# EAGLE design portable_tpa6138a2 (EAGLE 6.4)
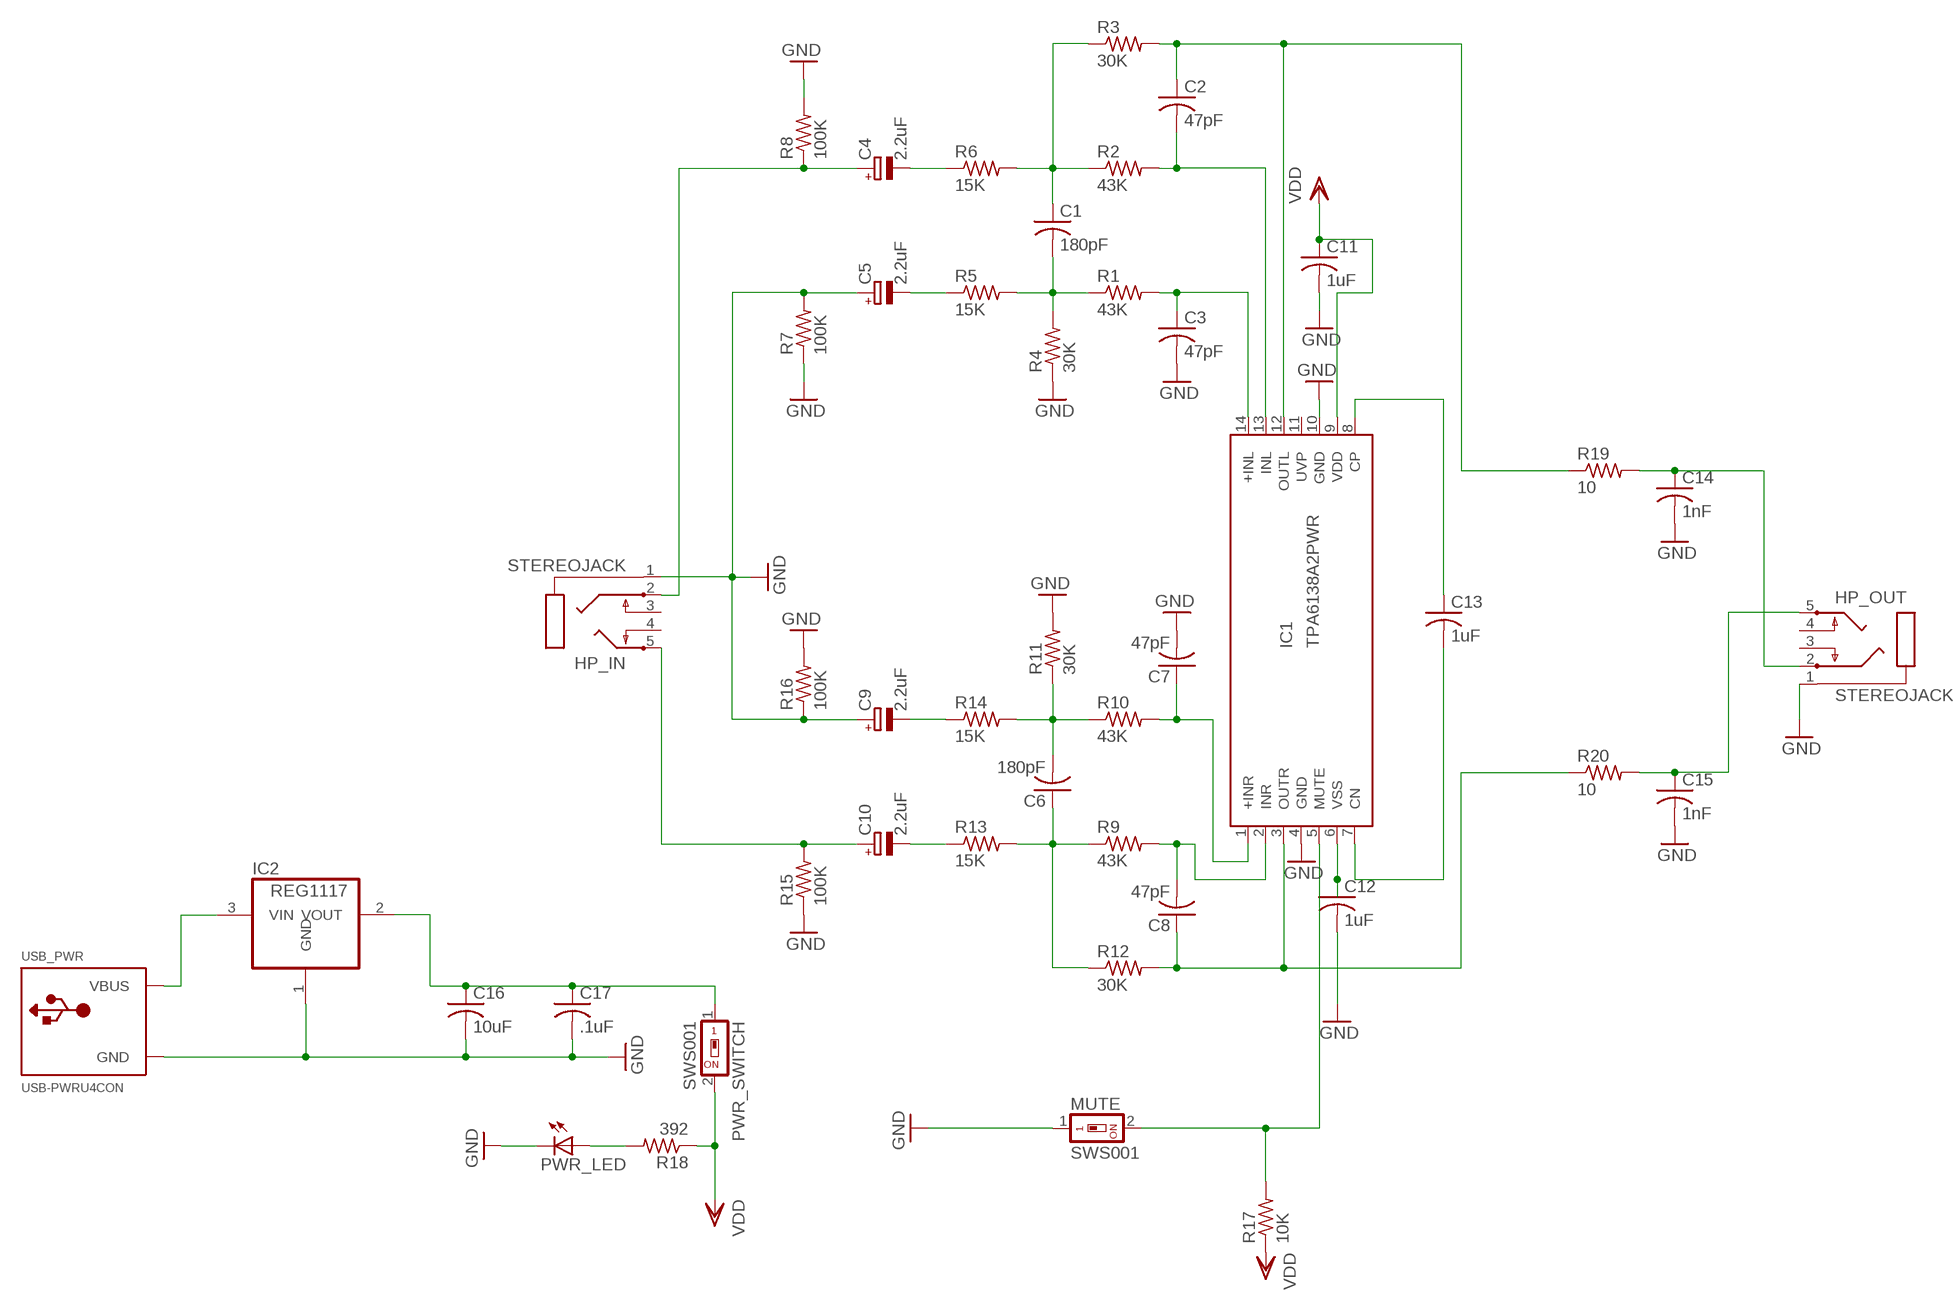
[diagram p0: schematic, sheet 1]

## Parts
C1  180pF  C-USC0603  [C0603]
C2  47pF  C-USC0603  [C0603]
C3  47pF  C-USC0603  [C0603]
C4  2.2uF  CPOL-EU153CLV-0405  [153CLV-0405]
C5  2.2uF  CPOL-EU153CLV-0405  [153CLV-0405]
C6  180pF  C-USC0603  [C0603]
C7  47pF  C-USC0603  [C0603]
C8  47pF  C-USC0603  [C0603]
C9  2.2uF  CPOL-EU153CLV-0405  [153CLV-0405]
C10  2.2uF  CPOL-EU153CLV-0405  [153CLV-0405]
C11  1uF  C-USC0603  [C0603]
C12  1uF  C-USC0603  [C0603]
C13  1uF  C-USC0603  [C0603]
C14  1nF  C-USC0603  [C0603]
C15  1nF  C-USC0603  [C0603]
C16  10uF  C-USC0805  [C0805]
C17  .1uF  C-USC0603  [C0603]
HP_IN  STEREOJACK  [STX3100]
HP_OUT  STEREOJACK  [STX3100]
IC1  TPA6138A2PWR  [TSSOP14]
IC2  REG1117  [SOT223]
MUTE  SWS001  [SMS-001]
PWR_LED  LED  [SMARTLED-TTW]
PWR_SWITCH  SWS001  [SMS-001]
R1  43K  R-US_R0603  [R0603]
R2  43K  R-US_R0603  [R0603]
R3  30K  R-US_R0603  [R0603]
R4  30K  R-US_R0603  [R0603]
R5  15K  R-US_R0603  [R0603]
R6  15K  R-US_R0603  [R0603]
R7  100K  R-US_R0603  [R0603]
R8  100K  R-US_R0603  [R0603]
R9  43K  R-US_R0603  [R0603]
R10  43K  R-US_R0603  [R0603]
R11  30K  R-US_R0603  [R0603]
R12  30K  R-US_R0603  [R0603]
R13  15K  R-US_R0603  [R0603]
R14  15K  R-US_R0603  [R0603]
R15  100K  R-US_R0603  [R0603]
R16  100K  R-US_R0603  [R0603]
R17  10K  R-US_R0603  [R0603]
R18  392  R-US_R0603  [R0603]
R19  10  R-US_R0603  [R0603]
R20  10  R-US_R0603  [R0603]
USB_PWR  USB-PWRU4CON  [USB-MINIB-THM-PWRONLY]

## Nets
GND: C3.2 C5.+ C7.2 C9.+ C11.2 C12.2 C14.2 C15.2 C16.2 C17.2 HP_IN.1 HP_OUT.1 IC1.4(GND) IC1.10(GND) IC2.1(GND) MUTE.1 PWR_LED.C@1(C) R4.1 R7.1 R7.2 R8.2 R11.2 R15.1 R16.1 R16.2 USB_PWR.GND
N$1: IC2.3(VIN) USB_PWR.VBUS
N$2: PWR_LED.A@1(A) R18.2
N$3: C4.+ HP_IN.2 R8.1
N$4: C4.- R6.1
N$5: C1.1 R2.1 R3.1 R6.2
N$6: C10.+ HP_IN.5 R15.2
N$7: C5.- R5.1
N$8: C1.2 R1.1 R4.2 R5.2
N$9: C2.2 IC1.13(INL) R2.2
N$10: C2.1 IC1.12(OUTL) R3.2 R19.1
N$11: C6.2 R10.1 R11.1 R14.2
N$12: C7.1 IC1.1(+INR) R10.2
N$13: C3.1 IC1.14(+INL) R1.2
N$14: C10.- R13.1
N$15: C6.1 R9.1 R12.1 R13.2
N$16: C8.2 IC1.2(INR) R9.2
N$17: C8.1 IC1.3(OUTR) R12.2 R20.1
N$18: C13.2 IC1.7(CN)
N$19: C13.1 IC1.8(CP)
N$20: C12.1 IC1.6(VSS)
N$21: C14.1 HP_OUT.2 R19.2
N$22: C15.1 HP_OUT.5 R20.2
N$23: C9.- R14.1
N$25: IC1.5(MUTE) MUTE.2 R17.2
N$26: C16.1 C17.1 IC2.2(VOUT) PWR_SWITCH.1
VDD: C11.1 IC1.9(VDD) PWR_SWITCH.2 R17.1 R18.1
Unconnected: HP_IN.3 HP_IN.4 HP_OUT.3 HP_OUT.4 IC1.11(UVP)

## Library data of the parts
C1-C3 C6-C8 C11-C17 = rcl:C-US: CAPACITOR, American symbol
C4 C5 C9 C10 = rcl:CPOL-EU: POLARIZED CAPACITOR, European symbol
HP_IN HP_OUT = adafruit:STEREOJACK: MIC/HEADPHONE JACK Stereo jack with two switches. Kycon STX3100, CUI SJ1-3555NG and/or 4UCon 05544
IC1 = TPA6138A2PWR:TPA6138A2PWR: edit this description Auto generated by make-symbol-device-package-bsdl.ulp Rev. 43 Source:
IC2 = burr-brown:REG1117: 800mA and 1A Low Dropout (LDO) Positive Regulator 1.8V, 2.5V, 2.85V, 3.3V, 5V, and Adj; MPN: REG1117; OC_FARNELL: 1097566; OC_NEWARK: 14P6981
MUTE PWR_SWITCH = smd-special:SWS001: SMD Dip Switch 1 pol.
PWR_LED = led:LED: LED OSRAM: - CHIPLED LG R971, LG N971, LY N971, LG Q971, LY Q971, LO R971, LY R971 LH N974, LH R974 LS Q976, LO Q976, LY Q976 LO Q996 - Hyper CHIPLED LW Q18S LB Q993, LB Q99A, LB R99A - SideLED LS A670, LO A670, LY A670, LG A670, LP A670 LB A673, LV A673, LT A673, LW A673 LH A674 LY A675 LS A676, LA A676, LO A676, LY A676, LW A676 LS A679, LY A679, LG A679 - Hyper Micro SIDELED® LS Y876, LA Y876, LO Y876, LY Y876 LT Y87S - SmartLED LW L88C, LW L88S LB L89C, LB L89S, LG L890 LS L89K, LO L89K, LY L89K LS L896, LA L896, LO L896, LY L896 - TOPLED LS T670, LO T670, LY T670, LG T670, LP T670 LSG T670, LSP T670, LSY T670, LOP T670, LYG T670 LG T671, LOG T671, LSG T671 LB T673, LV T673, LT T673, LW T673 LH T674 LS T676, LA T676, LO T676, LY T676, LB T676, LH T676, LSB T676, LW T676 LB T67C, LV T67C, LT T67C, LS T67K, LO T67K, LY T67K, LW E67C LS E67B, LA E67B, LO E67B, LY E67B, LB E67C, LV E67C, LT E67C LW T67C LS T679, LY T679, LG T679 LS T770, LO T770, LY T770, LG T770, LP T770 LB T773, LV T773, LT T773, LW T773 LH T774 LS E675, LA E675, LY E675, LS T675 LS T776, LA T776, LO T776, LY T776, LB T776 LHGB T686 LT T68C, LB T68C - Hyper Mini TOPLED® LB M676 - Mini TOPLED Santana® LG M470 LS M47K, LO M47K, LY M47K Source: http://www.osram.convergy.de LUXEON: - LUMILED® LXK2-PW12-R00, LXK2-PW12-S00, LXK2-PW14-U00, LXK2-PW14-V00 LXK2-PM12-R00, LXK2-PM12-S00, LXK2-PM14-U00 LXK2-PE12-Q00, LXK2-PE12-R00, LXK2-PE12-S00, LXK2-PE14-T00, LXK2-PE14-U00 LXK2-PB12-K00, LXK2-PB12-L00, LXK2-PB12-M00, LXK2-PB14-N00, LXK2-PB14-P00, LXK2-PB14-Q00 LXK2-PR12-L00, LXK2-PR12-M00, LXK2-PR14-Q00, LXK2-PR14-R00 LXK2-PD12-Q00, LXK2-PD12-R00, LXK2-PD12-S00 LXK2-PH12-R00, LXK2-PH12-S00 LXK2-PL12-P00, LXK2-PL12-Q00, LXK2-PL12-R00 Source: www.luxeon.com KINGBRIGHT: KA-3528ASYC Source: www.kingbright.com
R1-R20 = rcl:R-US_: RESISTOR, American symbol
USB_PWR = adafruit:USB-PWR

## Board
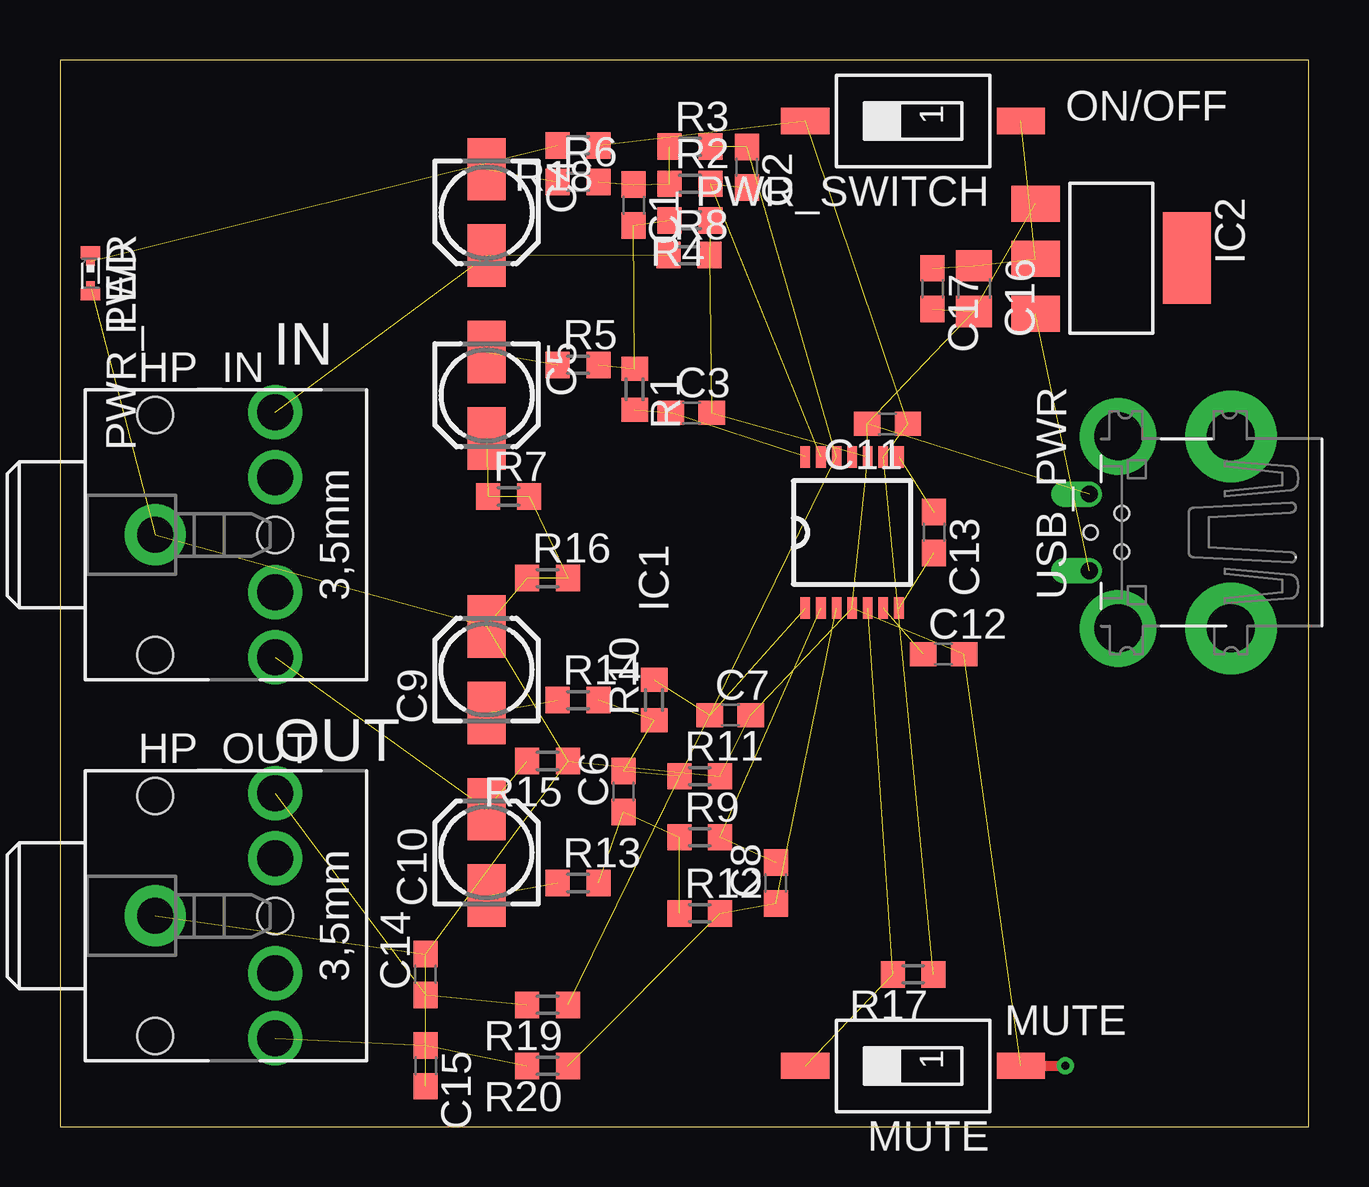
[diagram p1: board, top side]
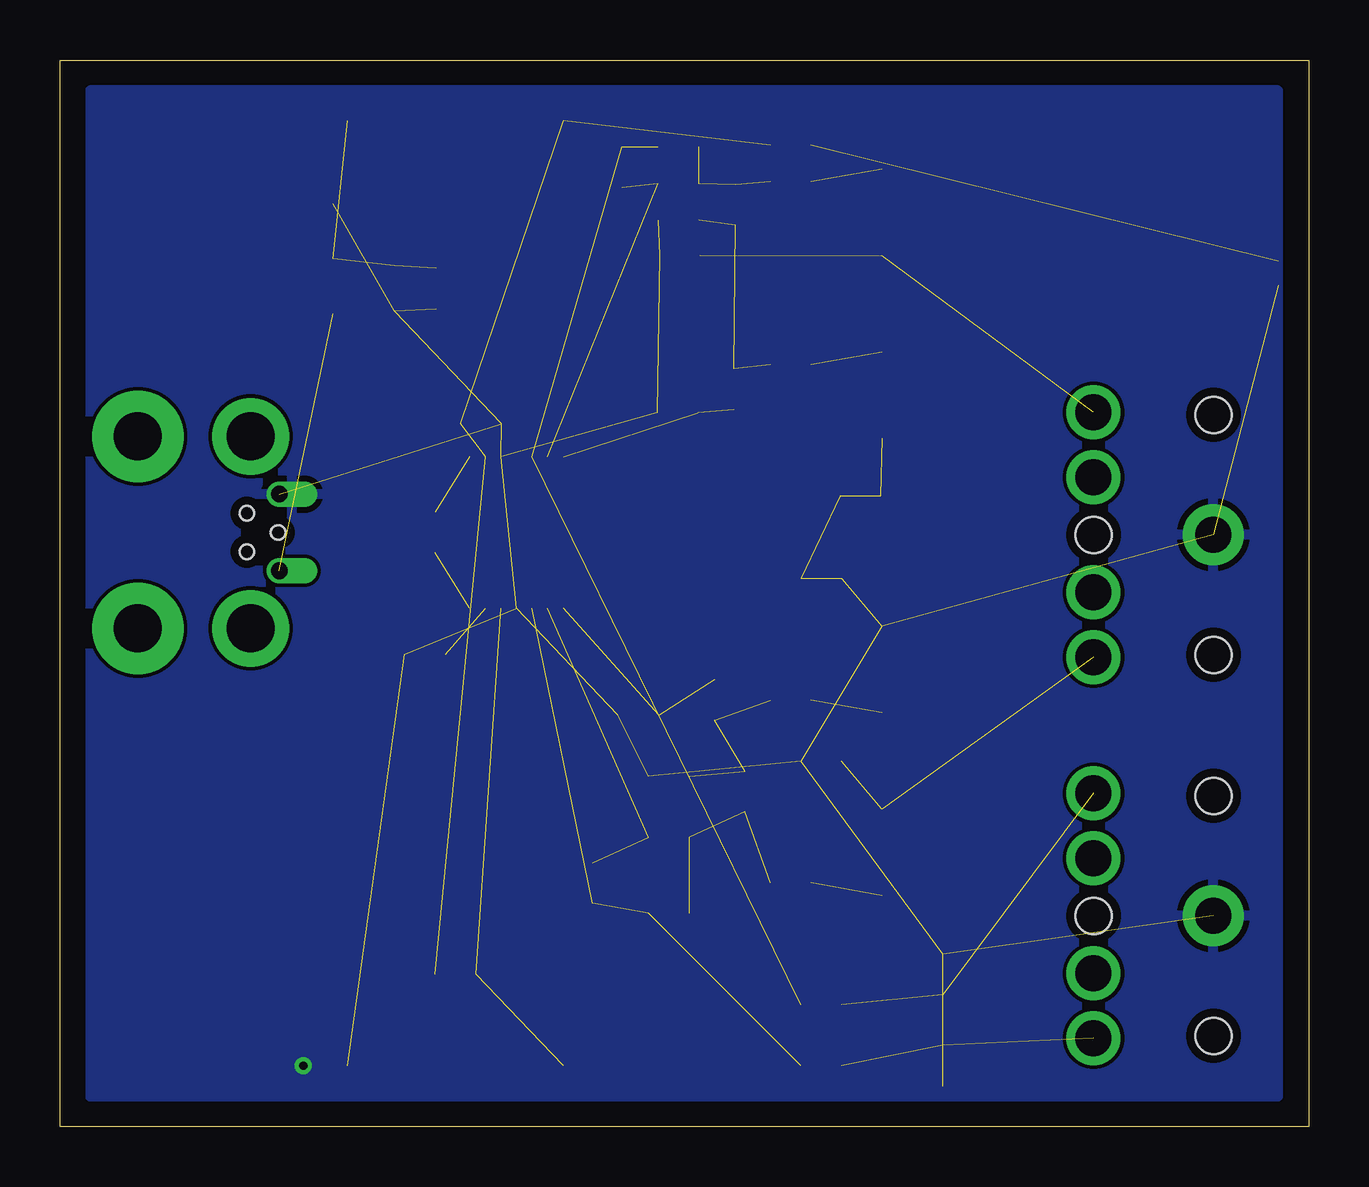
[diagram p2: board, bottom side, seen from below]

Size 52.05 x 44.45 mm. Coordinates in mm from the lower left corner, seen from the top.
Outline: 0,0 52.05,0 52.05,44.45 0,44.45 0,0
Copper layers (1*16): Top 0.0356mm / dielectric 1.5011mm / Bottom 0.0356mm
Design rules "LaenPCBOrder *": minimum track width 6mil, minimum drill 13mil, track to track 6mil, track to pad 6mil, pad to pad 6mil, via to via 6mil, smd to smd 6mil, copper to edge 15mil, drill to drill 6mil, minimum pad ring 7mil, minimum via ring 7mil, stop-mask expansion 4mil, vias tented up to drill 24mil, thermal gap 10mil

### Footprints (pad centres in the part's own frame; a part is rotated, then mirrored left to right if it is on the bottom)
C0603 = smd 1.1 x 1: 1 -0.85,0; 2 0.85,0
153CLV-0405 = smd 2.6 x 1.6: + 1.8,0; - -1.8,0
C0805 = smd 1.3 x 1.5: 1 -0.95,0; 2 0.95,0
STX3100 = drill 1.5 pad 2.54: 1 2.7,-0.1 | drill 1.5: 2 7.7,5; 3 7.7,2.3; 4 7.7,-2.5; 5 7.7,-5.2 | hole 1.5: 2.7,4.9; 2.7,-5.1; 7.7,-0.1
TSSOP14 = smd 0.9 x 0.4: 1 -3.15,1.95; 2 -3.15,1.3; 3 -3.15,0.65; 4 -3.15,0; 5 -3.15,-0.65; 6 -3.15,-1.3; 7 -3.15,-1.95; 8 3.15,-1.95; 9 3.15,-1.3; 10 3.15,-0.65; 11 3.15,0; 12 3.15,0.65; 13 3.15,1.3; 14 3.15,1.95
SOT223 = smd 1.499 x 2.007: 1 -2.261,-3.15; 2 0.025,-3.15; 3 2.311,-3.15 | smd 3.81 x 2.007: 4 0,3.15
SMS-001 = smd 1.092 x 2.007: 1 0,-4.496; 2 0,4.496
SMARTLED-TTW = smd 0.8 x 0.5: A 0,-0.875; C 0,0.875 | smd 0.35 x 0.35: A@1 0,-0.5; C@1 0,0.5
R0603 = smd 1 x 1.1: 1 -0.85,0; 2 0.85,0
USB-MINIB-THM-PWRONLY = drill 0.7 offset: GND 1.6,4.72; VBUS -1.6,4.72 | drill 2 pad 3.81: GND1 -4,-1.18; GND4 4,-1.18 | drill 2 pad 3.2: GND2 -4,3.52; GND3 4,3.52 | hole 0.6: -0.8,3.37; 0.8,3.37; 0,4.67

### Placement (x,y rotation side)
C1  23.9,38.4 270 top
C2  28.63,39.98 270 top
C3  26.31,29.74 0 top
C4  17.78,38.1 270 top
C5  17.78,30.48 270 top
C6  23.5,13.97 90 top
C7  27.94,17.14 0 top
C8  29.84,10.16 90 top
C9  17.78,19.05 90 top
C10  17.78,11.43 90 top
C11  34.49,29.29 180 top
C12  36.83,19.68 0 top
C13  36.42,24.76 270 top
C14  15.24,6.35 90 top
C15  15.24,2.54 270 top
C16  38.1,34.92 270 top
C17  36.37,34.92 270 top
HP_IN  1.27,24.76 0 top
HP_OUT  1.27,8.89 0 top
IC1  33.02,24.76 90 top
IC2  43.81,36.2 270 top
MUTE  35.56,2.54 90 top
PWR_LED  1.27,35.56 180 top
PWR_SWITCH  35.56,41.91 90 top
R1  23.95,30.73 270 top
R2  26.26,39.29 0 top
R3  26.26,40.84 0 top
R4  26.26,37.77 180 top
R5  21.59,31.75 0 top
R6  21.59,39.37 0 top
R7  18.69,26.26 0 top
R8  26.21,36.32 0 top
R9  26.67,12.07 0 top
R10  24.77,17.78 90 top
R11  26.67,14.61 0 top
R12  26.67,8.89 0 top
R13  21.59,10.16 0 top
R14  21.59,17.78 0 top
R15  20.32,15.24 180 top
R16  20.32,22.86 0 top
R17  35.56,6.35 180 top
R18  21.59,40.89 180 top
R19  20.32,5.08 180 top
R20  20.32,2.54 180 top
USB_PWR  47.62,24.76 90 top

### Tracks (layer width: path | path; a pad name or v marks a point on that pad's centre or on a via)
GND  (via drill 0.35)  (25 unrouted)
  Top 0.406: IC2.1 40.66,38.76 | MUTE.1 v41.91,2.54
  pour Bottom: 1.27,43.18 50.8,43.18 50.8,1.27 1.27,1.27
N$1  (1 unrouted)
N$2  (1 unrouted)
N$3  (2 unrouted)
N$4  (1 unrouted)
N$5  (3 unrouted)
N$6  (2 unrouted)
N$7  (1 unrouted)
N$8  (3 unrouted)
N$9  (2 unrouted)
N$10  (3 unrouted)
N$11  (3 unrouted)
N$12  (2 unrouted)
N$13  (2 unrouted)
N$14  (1 unrouted)
N$15  (3 unrouted)
N$16  (2 unrouted)
N$17  (3 unrouted)
N$18  (1 unrouted)
N$19  (1 unrouted)
N$20  (1 unrouted)
N$21  (2 unrouted)
N$22  (2 unrouted)
N$23  (1 unrouted)
N$25  (2 unrouted)
N$26  (3 unrouted)
VDD  (4 unrouted)

### Text on the board
tPlace: ON/OFF | PWR | IN | OUT | MUTE